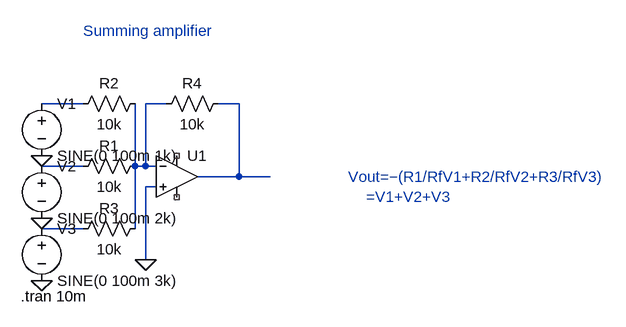
[diagram p0: schematic summing amplifier.asc]
summing amplifier.asc, the LTspice schematic file:
Version 4.1
SHEET 1 908 680
WIRE 48 32 -16 32
WIRE 176 32 144 32
WIRE 288 32 256 32
WIRE 48 128 -16 128
WIRE 128 128 128 32
WIRE 144 128 144 32
WIRE 144 128 128 128
WIRE 160 128 144 128
WIRE 288 144 288 32
WIRE 288 144 224 144
WIRE 336 144 288 144
WIRE 160 160 144 160
WIRE 48 224 -16 224
WIRE 128 224 128 128
WIRE 144 272 144 160
FLAG 144 272 0
FLAG -16 112 0
FLAG -16 208 0
FLAG -16 304 0
SYMBOL OpAmps\\UniversalOpAmp1 192 144 R0
SYMATTR InstName U1
SYMBOL res 144 112 R90
WINDOW 0 0 56 VBottom 2
WINDOW 3 32 56 VTop 2
SYMATTR InstName R1
SYMATTR Value 10k
SYMBOL res 144 16 R90
WINDOW 0 0 56 VBottom 2
WINDOW 3 32 56 VTop 2
SYMATTR InstName R2
SYMATTR Value 10k
SYMBOL res 144 208 R90
WINDOW 0 0 56 VBottom 2
WINDOW 3 32 56 VTop 2
SYMATTR InstName R3
SYMATTR Value 10k
SYMBOL res 272 16 R90
WINDOW 0 0 56 VBottom 2
WINDOW 3 32 56 VTop 2
SYMATTR InstName R4
SYMATTR Value 10k
SYMBOL voltage -16 16 R0
WINDOW 123 0 0 Left 0
WINDOW 39 0 0 Left 0
SYMATTR InstName V1
SYMATTR Value SINE(0 100m 1k)
SYMBOL voltage -16 112 R0
WINDOW 123 0 0 Left 0
WINDOW 39 0 0 Left 0
SYMATTR InstName V2
SYMATTR Value SINE(0 100m 2k)
SYMBOL voltage -16 208 R0
WINDOW 123 0 0 Left 0
WINDOW 39 0 0 Left 0
SYMATTR InstName V3
SYMATTR Value SINE(0 100m 3k)
TEXT -48 328 Left 2 !.tran 10m
TEXT 456 144 Left 2 ;Vout​=−(R1​/Rf​​V1​+R2/​Rf​​V2​+R3/​Rf​​V3​)\n    =V1+V2+V3
TEXT 48 -80 Left 2 ;Summing amplifier

The netlist it stands for:
* summing amplifier.asc
X§U1 0 N002 NC_01 NC_02 N003 level1 Avol=1Meg GBW=10Meg Vos=0 En=0 Enk=0 In=0 Ink=0 Rin=500Meg  ; pins In+ In- V+ V- OUT
R1 N002 N004 10k
R2 N002 N001 10k
R3 N002 N005 10k
R4 N003 N002 10k
V1 N001 0 SINE(0 100m 1k)
V2 N004 0 SINE(0 100m 2k)
V3 N005 0 SINE(0 100m 3k)
.tran 10m
* Vout​=−(R1​/Rf​​V1​+R2/​Rf​​V2​+R3/​Rf​​V3​)
*     =V1+V2+V3
* Summing amplifier
.lib UniversalOpAmp1.lib
.backanno
.end